# Altium schematic sheet Motor.SchDoc
size A4
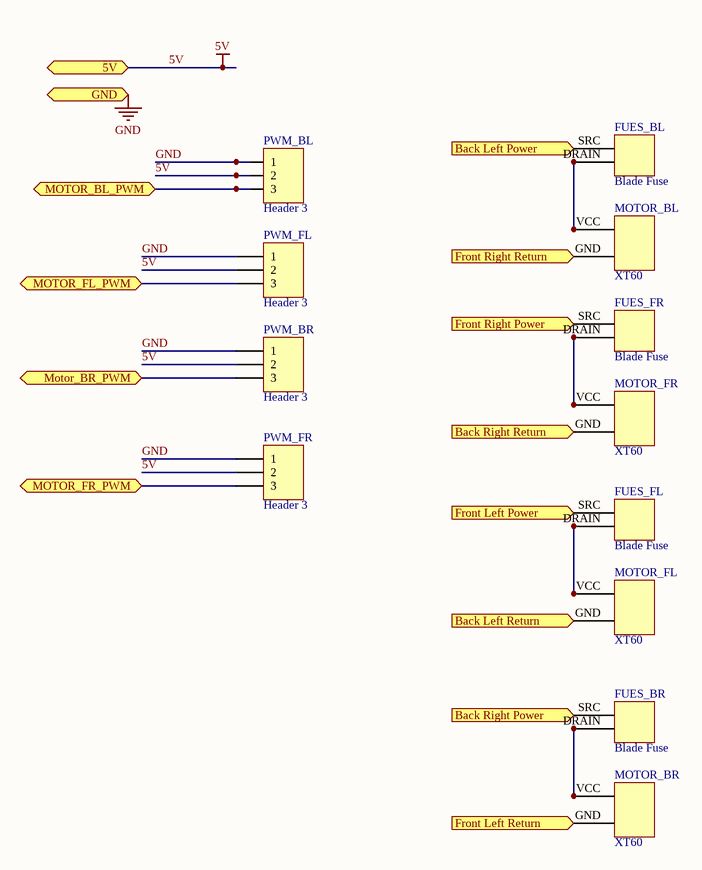
[diagram p0: Motor.SchDoc]

## Parts
FUES_BL  Blade Fuse  [Blade Fuse Holder]
FUES_BR  Blade Fuse  [Blade Fuse Holder]
FUES_FL  Blade Fuse  [Blade Fuse Holder]
FUES_FR  Blade Fuse  [Blade Fuse Holder]
MOTOR_BL  XT60  [XT60]
MOTOR_BR  XT60  [XT60]
MOTOR_FL  XT60  [XT60]
MOTOR_FR  XT60  [XT60]
PWM_BL  Header 3  [HDR1X3]
PWM_BR  Header 3  [HDR1X3]
PWM_FL  Header 3  [HDR1X3]
PWM_FR  Header 3  [HDR1X3]

## Ports
5V, Back Left Power, Back Left Return, Back Right Power, Back Right Return, Front Left Power, Front Left Return, Front Right Power, Front Right Return, GND, MOTOR_BL_PWM, Motor_BR_PWM, MOTOR_FL_PWM, MOTOR_FR_PWM

## Nets
5V: PWM_BL.2 PWM_BR.2 PWM_FL.2 PWM_FR.2 ; port 5V
GND: PWM_BL.1 PWM_BR.1 PWM_FL.1 PWM_FR.1 ; port GND
Back Left Power: FUES_BL.SRC ; port Back Left Power
Back Left Return: MOTOR_FL.GND ; port Back Left Return
Back Right Power: FUES_BR.SRC ; port Back Right Power
Back Right Return: MOTOR_FR.GND ; port Back Right Return
Front Left Power: FUES_FL.SRC ; port Front Left Power
Front Left Return: MOTOR_BR.GND ; port Front Left Return
Front Right Power: FUES_FR.SRC ; port Front Right Power
Front Right Return: MOTOR_BL.GND ; port Front Right Return
MOTOR_BL_PWM: PWM_BL.3 ; port MOTOR_BL_PWM
Motor_BR_PWM: PWM_BR.3 ; port Motor_BR_PWM
MOTOR_FL_PWM: PWM_FL.3 ; port MOTOR_FL_PWM
MOTOR_FR_PWM: PWM_FR.3 ; port MOTOR_FR_PWM
NetFUES_BL_DRAIN: FUES_BL.DRAIN MOTOR_BL.VCC
NetFUES_BR_DRAIN: FUES_BR.DRAIN MOTOR_BR.VCC
NetFUES_FL_DRAIN: FUES_FL.DRAIN MOTOR_FL.VCC
NetFUES_FR_DRAIN: FUES_FR.DRAIN MOTOR_FR.VCC

## Notes on the sheet
- Title
- Size:
- Date:
- A4
- Number:
- Time:
- Revision:
- Sheet
- of
- File:

## Library data of the parts
PWM_BL PWM_BR PWM_FL PWM_FR = Header 3: Header, 3-Pin; LatestRevisionDate: 17-Jul-2002; LatestRevisionNote: Re-released for DXP Platform.; Publisher: Altium Limited